# EAGLE design load (EAGLE 7.7.0)
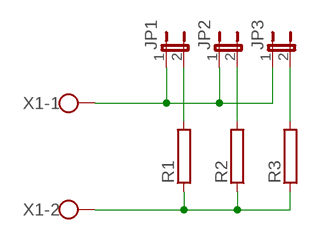
[diagram p0: schematic, sheet 1]

## Parts
JP1  JP1E  [JP1]
JP2  JP1E  [JP1]
JP3  JP1E  [JP1]
R1  RRWM8X26  [RWM8X26]
R2  RRWM8X26  [RWM8X26]
R3  RRWM8X26  [RWM8X26]
X1  W237-02P  [W237-132]

## Nets
GND: R1.1 R2.1 R3.1 X1.2
N$1: JP1.2 R1.2
N$2: JP2.2 R2.2
N$3: JP3.2 R3.2
VCC: JP1.1 JP2.1 JP3.1 X1.1

## Library data of the parts
JP1-JP3 = jumper:JP1E: JUMPER
R1-R3 = resistor-power:R: Power Resitor; OC_FARNELL: unknown; OC_NEWARK: unknown
X1 = con-wago-508:W237-02P: WAGO SREW CLAMP

## Board
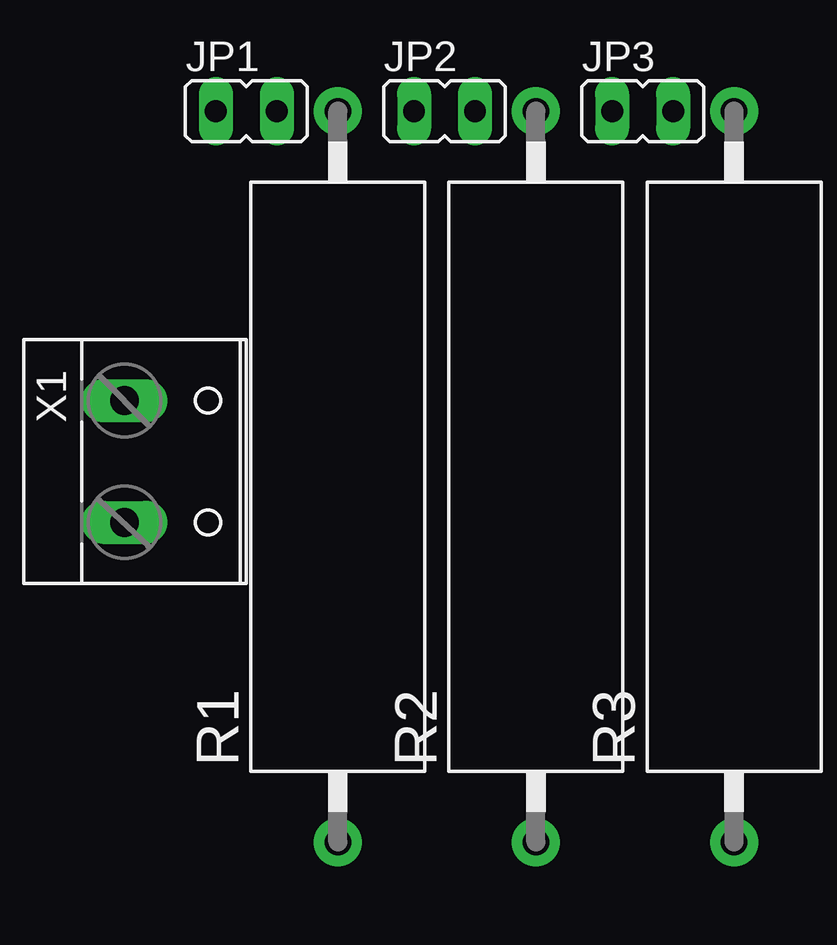
[diagram p1: board, top side]
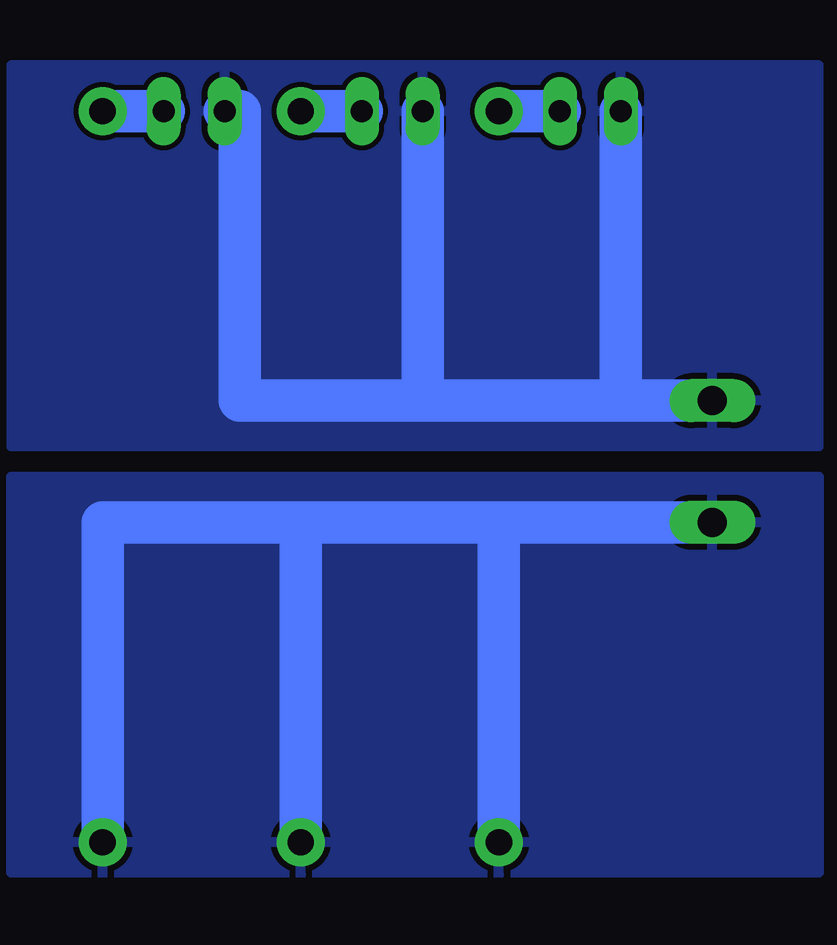
[diagram p2: board, bottom side, seen from below]

No outline drawn. Coordinates in mm, seen from the top.
Copper layers (1*16): Top 0.035mm / dielectric 1.5mm / Bottom 0.035mm
Design rules "default": minimum track width 10mil, minimum drill 24mil, track to track 8mil, track to pad 8mil, pad to pad 8mil, via to via 8mil, smd to smd 8mil, copper to edge 40mil, drill to drill 8mil, minimum pad ring 10mil, minimum via ring 8mil, stop-mask expansion 4mil, vias tented up to drill 0mil, thermal gap 10mil

### Footprints (pad centres in the part's own frame; a part is rotated, then mirrored left to right if it is on the bottom)
JP1 = drill 0.914 long: 1 0,-1.27; 2 0,1.27
RWM8X26 = drill 1.1 pad 2: 1 -15.24,0; 2 15.24,0
W237-132 = drill 1.194 long: 1 -2.54,-0.635; 2 2.54,-0.635

### Placement (x,y rotation side)
JP1  9.53,31.75 270 top
JP2  17.78,31.75 270 top
JP3  26.04,31.75 270 top
R1  13.34,16.51 90 top
R2  21.59,16.51 90 top
R3  29.84,16.51 90 top
X1  5.08,17.14 270 top

### Tracks (layer width: path | path; a pad name or v marks a point on that pad's centre or on a via)
GND
  Bottom 1.778: X1.2 13.34,14.61 | 13.34,14.61 21.59,14.61 | 21.59,14.61 29.84,14.61 R3.1 | R2.1 21.59,14.61 | R1.1 13.34,14.61
  pour Bottom: 0,0 33.66,0 33.66,16.51 0,16.51
N$1
  Bottom 1.778: R1.2 JP1.2
N$2
  Bottom 1.778: R2.2 JP2.2
N$3
  Bottom 1.778: R3.2 JP3.2
VCC
  Bottom 1.778: X1.1 8.26,19.68 | 8.26,19.68 JP1.1 | JP2.1 16.51,20.32 16.51,19.68 | 16.51,19.68 8.26,19.68 | JP3.1 24.13,31.75 24.13,19.68 16.51,19.68
  pour Bottom: 0,33.66 33.66,33.66 33.66,17.78 0,17.78